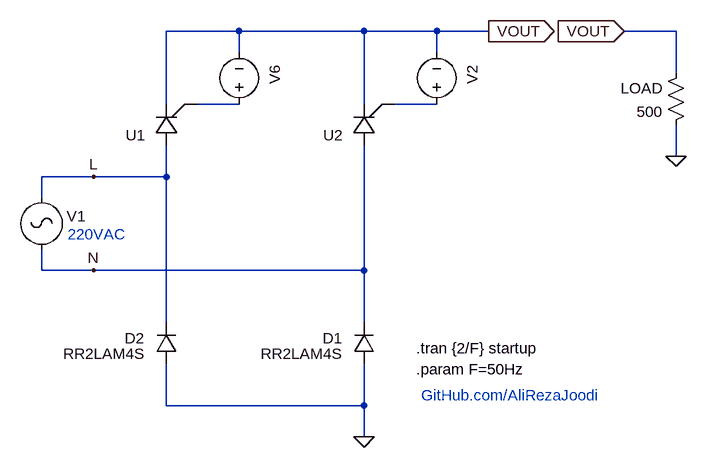
[diagram p0: schematic _Patern.asc]
_Patern.asc, the LTspice schematic file:
Version 4.1
SHEET 1 3704 2788
WIRE 320 -112 208 -112
WIRE 512 -112 320 -112
WIRE 624 -112 512 -112
WIRE 704 -112 624 -112
WIRE 992 -112 912 -112
WIRE 320 -80 320 -112
WIRE 624 -80 624 -112
WIRE 992 -48 992 -112
WIRE 208 0 208 -112
WIRE 320 0 256 0
WIRE 512 0 512 -112
WIRE 624 0 560 0
WIRE 992 80 992 32
WIRE 96 112 16 112
WIRE 208 112 208 64
WIRE 208 112 96 112
WIRE 16 144 16 112
WIRE 16 256 16 224
WIRE 96 256 16 256
WIRE 512 256 512 64
WIRE 512 256 96 256
WIRE 208 336 208 112
WIRE 512 336 512 256
WIRE 208 464 208 400
WIRE 512 464 512 400
WIRE 512 464 208 464
WIRE 512 512 512 464
FLAG 96 112 L
FLAG 512 512 0
FLAG 912 -112 VOUT
IOPIN 912 -112 In
FLAG 704 -112 VOUT
IOPIN 704 -112 Out
FLAG 96 256 N
FLAG 992 80 0
SYMBOL res 1008 -64 M0
SYMATTR InstName LOAD
SYMATTR Value 500
SYMBOL MyLib\\Voltage_AC 16 128 M0
WINDOW 123 0 0 Left 0
WINDOW 39 0 0 Left 0
WINDOW 3 41 64 Invisible 2
WINDOW 0 -68 45 Left 2
SYMATTR Value SINE(0 325 {F})
SYMATTR InstName V1
SYMBOL MyLib\\Thyristor_SCR\\S8020L 224 64 R180
WINDOW 38 48 39 Invisible 2
SYMATTR InstName U1
SYMBOL MyLib\\Thyristor_SCR\\S8020L 528 64 R180
WINDOW 38 48 39 Invisible 2
SYMATTR InstName U2
SYMBOL voltage 320 16 R180
WINDOW 3 -49 -29 Invisible 2
WINDOW 123 0 0 Left 0
WINDOW 0 -55 46 VRight 2
SYMATTR Value PULSE(0 12 4m 1n 1n 200u {1/F})
SYMATTR InstName V6
SYMATTR SpiceLine Rser=100
SYMBOL voltage 624 16 R180
WINDOW 3 -49 -29 Invisible 2
WINDOW 123 0 0 Left 0
WINDOW 0 -55 46 VRight 2
SYMATTR Value PULSE(0 12 14m 1n 1n 200u {1/F})
SYMATTR InstName V2
SYMATTR SpiceLine Rser=100
SYMBOL diode 224 400 R180
WINDOW 0 49 40 Left 2
WINDOW 3 48 16 Left 2
SYMATTR InstName D2
SYMATTR Value RR2LAM4S
SYMBOL diode 528 400 R180
WINDOW 0 49 40 Left 2
WINDOW 3 48 16 Left 2
SYMATTR InstName D1
SYMATTR Value RR2LAM4S
TEXT 592 376 Left 2 !.tran {2/F} startup
TEXT 56 200 Left 2 ;220VAC
TEXT 600 448 Left 2 ;GitHub.com/AliRezaJoodi
TEXT 592 408 Left 2 !.param F=50Hz

The netlist it stands for:
* _Patern.asc
R§LOAD VOUT 0 500
V1 L N SINE(0 325 {F})
X§U1 L N001 VOUT S8020L  ; pins A G K
X§U2 N N002 VOUT S8020L  ; pins A G K
V6 N001 VOUT PULSE(0 12 4m 1n 1n 200u {1/F}) Rser=100
V2 N002 VOUT PULSE(0 12 14m 1n 1n 200u {1/F}) Rser=100
D2 0 L RR2LAM4S
D1 0 N RR2LAM4S
.model D D
.lib standard.dio
.tran {2/F} startup
* 220VAC
* GitHub.com/AliRezaJoodi
.param F=50Hz
.lib MyLib/Thyristor_SCR/_SCR_Littelfuse.lib
.backanno
.end